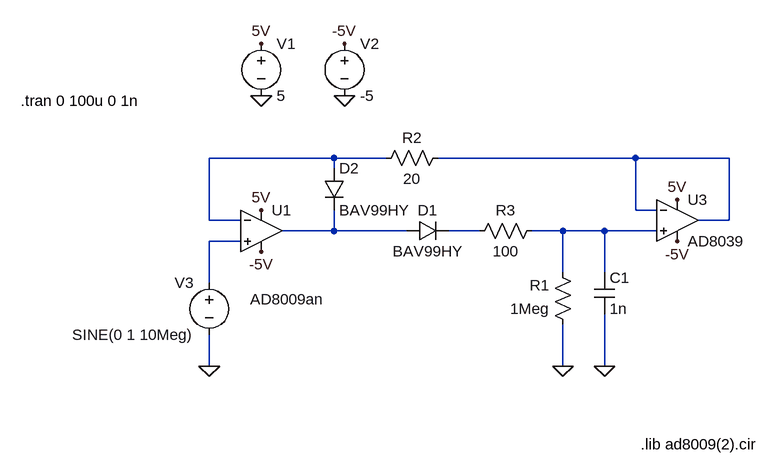
[diagram p0: schematic peak.asc]
peak.asc, the LTspice schematic file:
Version 4
SHEET 1 1232 680
WIRE 272 160 80 160
WIRE 352 160 272 160
WIRE 736 160 432 160
WIRE 880 160 736 160
WIRE 272 176 272 160
WIRE 736 240 736 160
WIRE 768 240 736 240
WIRE 80 256 80 160
WIRE 128 256 80 256
WIRE 880 256 880 160
WIRE 880 256 832 256
WIRE 272 272 272 240
WIRE 272 272 192 272
WIRE 384 272 272 272
WIRE 496 272 448 272
WIRE 624 272 576 272
WIRE 688 272 624 272
WIRE 768 272 688 272
WIRE 128 288 80 288
WIRE 624 336 624 272
WIRE 688 336 688 272
WIRE 80 352 80 288
WIRE 80 480 80 432
WIRE 624 480 624 416
WIRE 688 480 688 400
FLAG 160 64 0
FLAG 160 240 5V
FLAG 160 -16 5V
FLAG 288 64 0
FLAG 288 -16 -5V
FLAG 160 304 -5V
FLAG 624 480 0
FLAG 688 480 0
FLAG 80 480 0
FLAG 800 224 5V
FLAG 800 288 -5V
SYMBOL OpAmps\\opamp2 160 208 R0
WINDOW 3 -17 169 Left 2
SYMATTR InstName U1
SYMATTR Value AD8009an
SYMBOL voltage 160 -32 R0
WINDOW 123 0 0 Left 0
WINDOW 39 0 0 Left 0
SYMATTR InstName V1
SYMATTR Value 5
SYMBOL voltage 288 -32 R0
WINDOW 123 0 0 Left 0
WINDOW 39 0 0 Left 0
SYMATTR InstName V2
SYMATTR Value -5
SYMBOL diode 384 288 R270
WINDOW 0 32 32 VTop 2
WINDOW 3 0 32 VBottom 2
SYMATTR InstName D1
SYMATTR Value BAV99HY
SYMBOL res 640 432 R180
WINDOW 0 36 76 Left 2
WINDOW 3 36 40 Left 2
SYMATTR InstName R1
SYMATTR Value 1Meg
SYMBOL cap 672 336 R0
SYMATTR InstName C1
SYMATTR Value 1n
SYMBOL voltage 80 336 M0
WINDOW 123 0 0 Left 0
WINDOW 39 0 0 Left 0
SYMATTR InstName V3
SYMATTR Value SINE(0 1 10Meg)
SYMBOL res 448 144 R90
WINDOW 0 0 56 VBottom 2
WINDOW 3 32 56 VTop 2
SYMATTR InstName R2
SYMATTR Value 20
SYMBOL diode 256 176 R0
SYMATTR InstName D2
SYMATTR Value BAV99HY
SYMBOL res 592 256 R90
WINDOW 0 0 56 VBottom 2
WINDOW 3 32 56 VTop 2
SYMATTR InstName R3
SYMATTR Value 100
SYMBOL OpAmps\\AD8039 800 192 R0
SYMATTR InstName U3
TEXT -210 72 Left 2 !.tran 0 100u 0 1n
TEXT 744 600 Left 2 !.lib ad8009(2).cir

The netlist it stands for:
* peak.asc
XU1 N006 N001 5V -5V N003 AD8009an  ; pins In+ In- V+ V- OUT
V1 5V 0 5
V2 -5V 0 -5
D1 N003 N004 BAV99HY
R1 0 N005 1Meg
C1 N005 0 1n
V3 N006 0 SINE(0 1 10Meg)
R2 N002 N001 20
D2 N001 N003 BAV99HY
R3 N005 N004 100
XU3 N005 N002 5V -5V N002 AD8039  ; pins In+ In- V+ V- OUT
.model D D
.lib standard.dio
.tran 0 100u 0 1n
.lib ad8009(2).cir
.backanno
.end